# Altium schematic sheet Sheet1.SchDoc
size A4; SheetNumber: 1; SheetTotal: 1
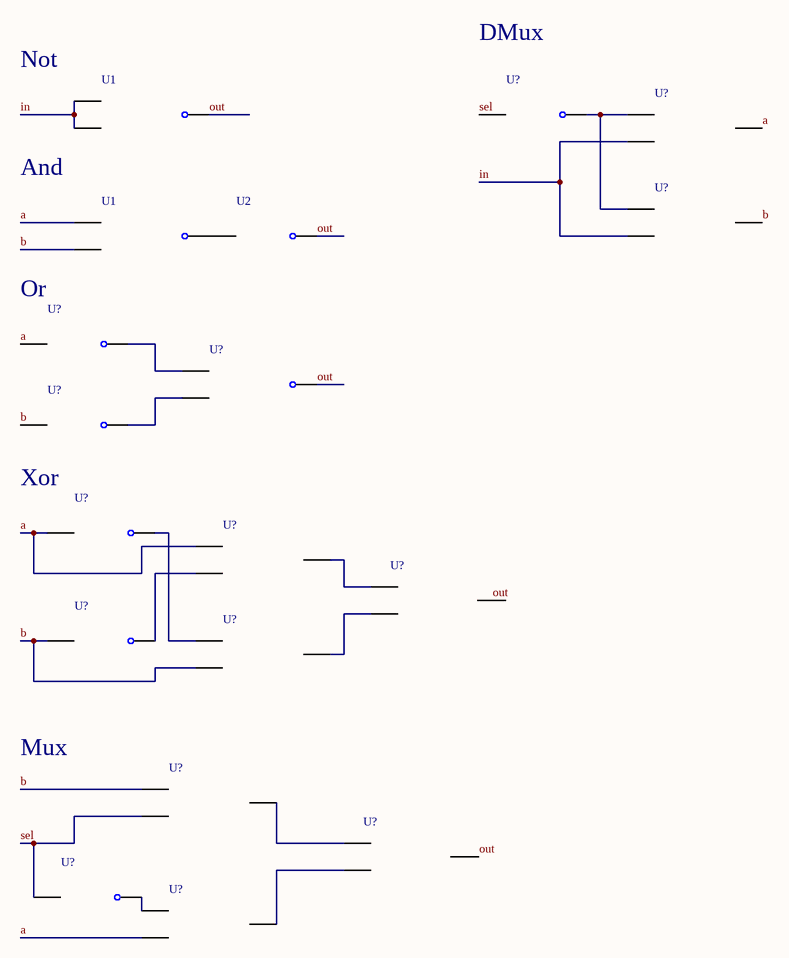
[diagram p0: Sheet1.SchDoc]

## Parts
(Parts that share a designator on the sheet are numbered #1, #2 ... from top to bottom, then left to right.)
U1#1  Digital NAND Gate  (value not drawn)
U1#2  Digital NAND Gate  (value not drawn)
U2  Digital NOT Gate  (value not drawn)
U?#1  Digital NOT Gate  (value not drawn)
U?#2  Digital AND Gate  (value not drawn)
U?#3  Digital AND Gate  (value not drawn)
U?#4  Digital NOT Gate  (value not drawn)
U?#5  Digital NAND Gate  (value not drawn)
U?#6  Digital NOT Gate  (value not drawn)
U?#7  Digital NOT Gate  (value not drawn)
U?#8  Digital AND Gate  (value not drawn)
U?#9  Digital OR Gate  (value not drawn)
U?#10  Digital NOT Gate  (value not drawn)
U?#11  Digital AND Gate  (value not drawn)
U?#12  Digital AND Gate  (value not drawn)
U?#13  Digital OR Gate  (value not drawn)
U?#14  Digital NOT Gate  (value not drawn)
U?#15  Digital AND Gate  (value not drawn)

## Nets
a: U1#2.1 U?#2.3 U?#4.1 U?#7.1 U?#8.1 U?#15.2
b: U1#2.2 U?#3.3 U?#6.1 U?#10.1 U?#11.2 U?#12.1
in: U1#1.1 U1#1.2 U?#2.2 U?#3.2
out: U1#1.3 U2.2 U?#5.3 U?#13.3
sel: U?#1.1 U?#12.2 U?#14.1
NetU1#2_3: U1#2.3 U2.1
NetU?#1_2: U?#1.2 U?#2.1 U?#3.1
NetU?#4_2: U?#4.2 U?#5.1
NetU?#5_2: U?#5.2 U?#6.2
NetU?#7_2: U?#7.2 U?#11.1
NetU?#8_2: U?#8.2 U?#10.2
NetU?#8_3: U?#8.3 U?#9.1
NetU?#9_2: U?#9.2 U?#11.3
NetU?#12_3: U?#12.3 U?#13.1
NetU?#13_2: U?#13.2 U?#15.3
NetU?#14_2: U?#14.2 U?#15.1

Not connected (* = marked no-connect by the designer): U?#9 3

## Notes on the sheet
- (near U1#1) Not
- DMux
- (near U1#1) And
- Or
- (near U?#6) Xor
- Mux
- Labels drawn without touching a wire or pin: out

## Library data of the parts
U1#1 U1#2 U?#5 = Digital NAND: rise_delay_inst: 1n; input_load_inst: 1p; SimulationGenericComponent: True; fall_delay_inst: 1n
U2 U?#1 U?#4 U?#6 U?#7 U?#10 U?#14 = Digital NOT: rise_delay_inst: 1n; input_load_inst: 1p; SimulationGenericComponent: True; fall_delay_inst: 1n
U?#2 U?#3 U?#8 U?#11 U?#12 U?#15 = Digital AND: rise_delay_inst: 1n; input_load_inst: 1p; SimulationGenericComponent: True; fall_delay_inst: 1n
U?#9 U?#13 = Digital OR: rise_delay_inst: 1n; input_load_inst: 1p; SimulationGenericComponent: True; fall_delay_inst: 1n